# EAGLE design vfdhack32db (EAGLE 9.6.2)
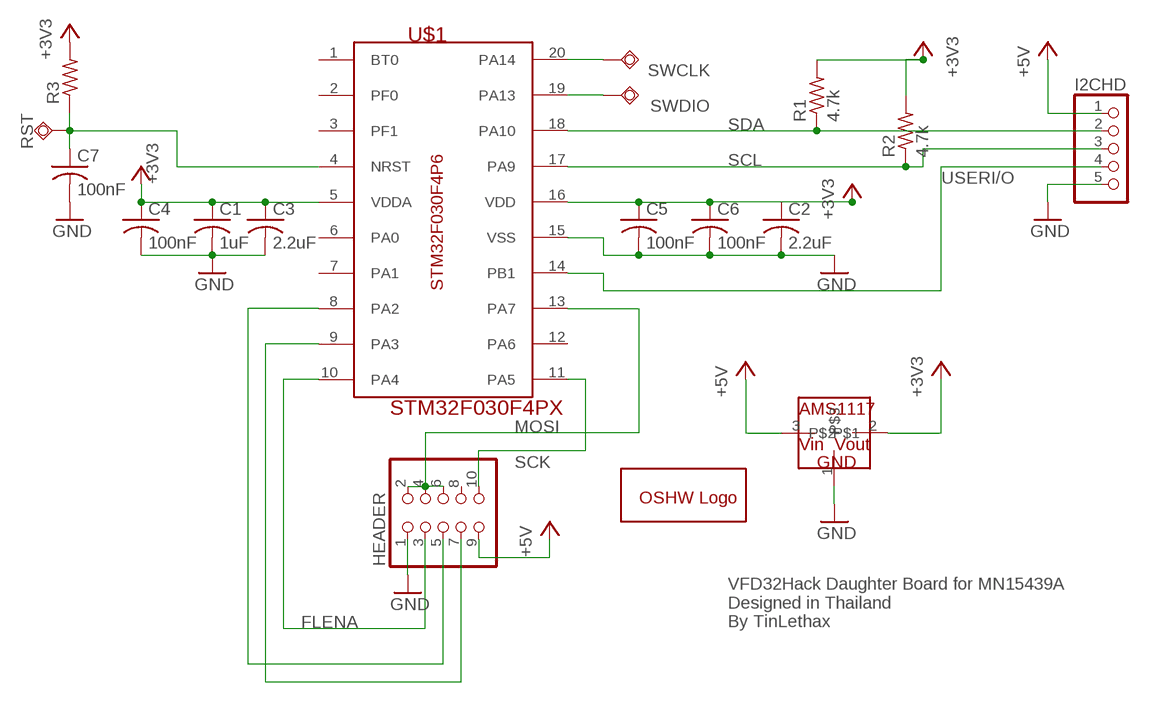
[diagram p0: schematic, sheet 1]

## Parts
C1  1uF  C-USC0603  [C0603]
C2  2.2uF  C-USC0603  [C0603]
C3  2.2uF  C-USC0603  [C0603]
C4  100nF  C-USC1206K  [C1206K]
C5  100nF  C-USC1206K  [C1206K]
C6  100nF  C-USC1206K  [C1206K]
C7  100nF  C-USC1206K  [C1206K]
GOLD_ORB_SM1  OSHWLOGOLOGO5MM  [OSHW_5MM]
HEADER  PINHD-2X5  [2X05]
I2CHD  PINHD-1X5  [1X05]
R1  4.7k  R-US_R0603  [R0603]
R2  4.7k  R-US_R0603  [R0603]
R3  R-US_R0603  [R0603]
RST  TPSQTP10SQ  [TP10SQ]
SWCLK  TPSQTP10SQ  [TP10SQ]
SWDIO  TPSQTP10SQ  [TP10SQ]
U$1  STM32F030F4PX  [SOP65P640X120-20N]
U$2  AMS1117  [SOT223]

## Nets
+3V3: C1.1 C2.1 C3.1 C4.1 C5.1 C6.1 R1.2 R2.2 R3.2 U$1.5(VDDA) U$1.16(VDD) U$2.2
+5V: HEADER.9 I2CHD.1 U$2.3
FLENA: HEADER.3 U$1.10(PA4)
GND: C1.2 C2.2 C3.2 C4.2 C5.2 C6.2 C7.2 HEADER.1 I2CHD.5 U$1.15(VSS) U$2.1
MOSI: HEADER.2 HEADER.4 HEADER.6 U$1.13(PA7)
N$2: C7.1 R3.1 RST.TP U$1.4(NRST)
N$3: SWCLK.TP U$1.20(PA14)
N$4: SWDIO.TP U$1.19(PA13)
N$5: HEADER.5 U$1.8(PA2)
N$6: HEADER.7 U$1.9(PA3)
SCK: HEADER.10 U$1.11(PA5)
SCL: I2CHD.3 R2.1 U$1.17(PA9)
SDA: I2CHD.2 R1.1 U$1.18(PA10)
USERI/O: I2CHD.4 U$1.14(PB1)
Unconnected: HEADER.8 U$1.1(BT0) U$1.2(PF0) U$1.3(PF1) U$1.6(PA0) U$1.7(PA1) U$1.12(PA6)

## Notes on the sheet
- VFD32Hack Daughter Board for MN15439A
  Designed in Thailand
  By TinLethax

## Library data of the parts
C1-C7 = adafruit:C-US: CAPACITOR, American symbol
GOLD_ORB_SM1 = oshw:OSHWLOGO: The OSHW logo for PCB layout
HEADER = pinhead:PINHD-2X5: PIN HEADER
I2CHD = pinhead:PINHD-1X5: PIN HEADER
R1-R3 = adafruit:R-US_: RESISTOR, American symbol
RST SWCLK SWDIO = testpad:TPSQ: Test pad
U$1 = stm32f030f4px:STM32F030F4PX: The STM32F030x4/x6/x8/xC microcontrollers incorporate the high-performance Arm® Cortex®-M0 32-bit RISC core operating at a 48 MHz frequency, high-speed embedded memories (up to 256 Kbytes of Flash memory and up to 32 Kbytes of SRAM), and an extensive range of enhanced peripherals and I/Os. All devices offer standard communication interfaces (up to two I2Cs, up to two SPIs and up to six USARTs), one 12-bit ADC, seven general-purpose 16-bit timers and an advanced-control PWM timer. The STM32F030x4/x6/x8/xC microcontrollers operate in the -40 to +85 °C temperature range from a 2.4 to 3.6V power supply. A comprehensive set of power-saving modes allows the design of low-power applications. The STM32F030x4/x6/x8/xC microcontrollers include devices in four different packages ranging from 20 pins to 64 pins. Depending on the device chosen, different sets of peripherals are included. The description below provides an overview of the complete range of STM32F030x4/x6/x8/xC peripherals proposed. These features make the STM32F030x4/x6/x8/xC microcontrollers suitable for a wide range of applications such as application control and user interfaces, handheld equipment, A/V receivers and digital TV, PC peripherals, gaming and GPS platforms, industrial applications, PLCs, inverters, printers, scanners, alarm systems, video intercoms, and HVACs.
U$2 = AMS1117:AMS1117: The The AMS1117 series of adjustable and fixed voltage regulators are designed to provide up to1A output current and to operate down to 1V input-to-output differential. The dropout voltage of the device is guaranteed maximum 1.3V, decreasing at lower load currents.; PARTNO: AMS1117

## Board
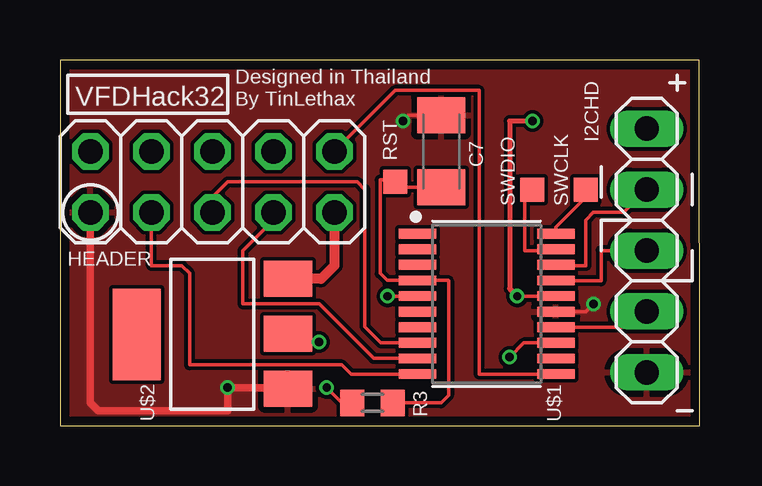
[diagram p1: board, top side]
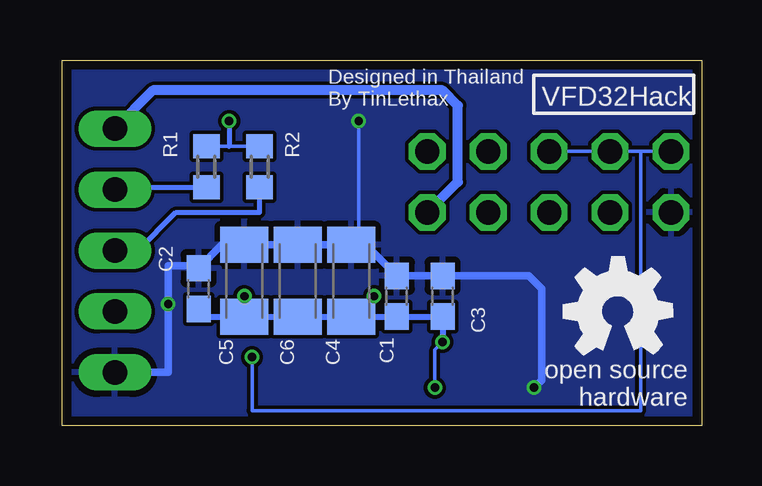
[diagram p2: board, bottom side, seen from below]

Size 26.65 x 15.24 mm. Coordinates in mm from the lower left corner, seen from the top.
Outline: 0,0 26.65,0 26.64,15.24 0,15.24 0,0
Copper layers (1*16): Top 0.035559375mm / dielectric 1.6mm / Bottom 0.035559375mm
Design rules "oshpark-2layer": minimum track width 6mil, minimum drill 10mil, track to track 6mil, track to pad 6mil, pad to pad 6mil, via to via 6mil, smd to smd 6mil, copper to edge 15mil, drill to drill 6mil, minimum pad ring 5mil, minimum via ring 5mil, stop-mask expansion 2.5mil, vias tented up to drill 0mil, thermal gap 10mil

### Footprints (pad centres in the part's own frame; a part is rotated, then mirrored left to right if it is on the bottom)
C0603 = smd 1.1 x 1: 1 -0.85,0; 2 0.85,0
C1206K = smd 1.5 x 2: 1 -1.5,0; 2 1.5,0
2X05 = drill 1.016 octagon: 1 -5.08,-1.27; 2 -5.08,1.27; 3 -2.54,-1.27; 4 -2.54,1.27; 5 0,-1.27; 6 0,1.27; 7 2.54,-1.27; 8 2.54,1.27; 9 5.08,-1.27; 10 5.08,1.27
1X05 = drill 1.016 long: 1 -5.08,0; 2 -2.54,0; 3 0,0; 4 2.54,0; 5 5.08,0
R0603 = smd 1 x 1.1: 1 -0.85,0; 2 0.85,0
TP10SQ = smd 1 x 1: TP 0,0
SOP65P640X120-20N = smd 1.559 x 0.407: 1 -2.878,2.925; 2 -2.878,2.275; 3 -2.878,1.625; 4 -2.878,0.975; 5 -2.878,0.325; 6 -2.878,-0.325; 7 -2.878,-0.975; 8 -2.878,-1.625; 9 -2.878,-2.275; 10 -2.878,-2.925; 11 2.878,-2.925; 12 2.878,-2.275; 13 2.878,-1.625; 14 2.878,-0.975; 15 2.878,-0.325; 16 2.878,0.325; 17 2.878,0.975; 18 2.878,1.625; 19 2.878,2.275; 20 2.878,2.925
SOT223 = smd 1.499 x 2.007: 1 -2.261,-3.15; 2 0.025,-3.15; 3 2.311,-3.15 | smd 3.81 x 2.007: 4 0,3.15

### Placement (x,y rotation side)
C1  12.7,5.4 90 bottom
C2  20.95,5.71 90 bottom
C3  10.79,5.4 90 bottom
C4  14.61,6.03 90 bottom
C5  19.05,6.03 90 bottom
C6  16.83,6.03 90 bottom
C7  15.88,11.43 90 top
GOLD_ORB_SM1  3.49,4.76 0 bottom
HEADER  6.35,10.16 0 top
I2CHD  24.45,7.3 270 top
R1  20.64,10.79 90 bottom
R2  18.41,10.79 90 bottom
R3  13.02,0.95 180 top
RST  13.97,10.16 0 top
SWCLK  21.91,9.84 0 top
SWDIO  19.68,9.84 0 top
U$1  17.78,5.08 0 top
U$2  6.35,3.81 90 top

### Tracks (layer width: path | path; a pad name or v marks a point on that pad's centre or on a via)
+3V3  (via drill 0.35)
  Top 0.152: v13.65,5.4 v13.66,5.41 U$1.5 | v19.05,5.4 v19.06,5.41 U$1.16 | R3.2 11.75,0.95 v11.11,1.59
  Top 0.203: v19.05,5.4 18.73,5.71 18.73,12.7 v19.68,12.7
  Top 0.254: v10.79,3.49 9.84,3.49 U$2.2
  Bottom 0.152: C4.1 13.74,5.4 v13.65,5.4 | C5.1 v19.05,5.4 | R1.2 19.68,11.64 R2.2 | v11.11,1.59 11.11,3.17 v10.79,3.49
  Bottom 0.203: v19.68,12.7 19.68,11.64
  Bottom 0.254: C2.1 20.62,4.53 C5.1 C6.1 C4.1 12.71,4.53 C1.1 C3.1 v10.79,3.49
+5V
  Top 0.406: HEADER.9 11.43,6.67 10.88,6.12 U$2.3
  Bottom 0.406: HEADER.9 10.16,10.16 10.16,13.34 10.79,13.97 22.86,13.97 I2CHD.1
FLENA
  Top 0.152: U$1.10 12.13,2.15 11.75,2.54 5.4,2.54 5.4,6.35 5.08,6.67 3.81,6.67 HEADER.3
GND  (via drill 0.35)
  Top 0.152: U$1.15 21.9,4.75 v22.23,5.08 | C7.2 14.52,12.93 v14.29,12.7
  Top 0.305: U$2.1 9.46,1.59 v6.99,1.59 6.99,0.64 1.59,0.64 1.27,0.95 HEADER.1
  Bottom 0.152: v14.29,12.7 14.29,7.85 C4.2
  Bottom 0.254: 19.99,7.53 C5.2 C6.2 15.33,7.53 15.24,7.62 14.69,7.62 C4.2
  Bottom 0.305: I2CHD.5 22.23,2.22 v22.23,5.08 22.23,6.67 21.06,6.67 C2.2 19.99,7.53 C4.2 13.98,7.53 C1.2 C3.2 7.2,6.25 6.67,5.71 6.67,1.91 v6.99,1.59
  pour Top: 0,15.24 26.67,15.24 26.67,0.32 26.67,0 0,0
  pour Bottom: 0,15.24 26.67,15.24 26.67,0 0,0
MOSI  (via drill 0.35)
  Top 0.152: U$1.13 19.33,3.46 v18.73,2.86
  Bottom 0.152: v18.73,2.86 18.73,0.64 2.54,0.64 2.54,11.43 | HEADER.2 2.54,11.43 | 2.54,11.43 HEADER.4 HEADER.6
N$2
  Top 0.152: C7.1 13.97,9.93 RST.TP 13.97,10.25 13.34,10.25 13.34,6.35 13.63,6.05 U$1.4 16.17,6.05 16.19,6.03 16.19,1.27 15.88,0.95 R3.1
N$3
  Top 0.152: SWCLK.TP 21.91,9.53 20.66,8.28 U$1.20
N$4
  Top 0.152: U$1.19 20.61,7.3 19.37,7.3 19.37,9.53 SWDIO.TP
N$5
  Top 0.152: HEADER.5 6.35,9.53 6.99,10.16 12.38,10.16 12.7,9.84 12.7,4.13 13.37,3.46 U$1.8
N$6
  Top 0.152: HEADER.7 8.89,8.57 7.62,7.3 7.62,5.08 10.79,5.08 13.07,2.81 U$1.9
SCK
  Top 0.152: U$1.11 17.46,2.15 17.46,13.97 13.97,13.97 HEADER.10
SCL
  Top 0.152: I2CHD.3 22.54,7.3 22.54,6.03 20.68,6.03 U$1.17
  Bottom 0.203: I2CHD.3 23.5,7.3 21.91,8.89 18.41,8.89 R2.1
SDA
  Top 0.152: I2CHD.2 23.5,8.89 22.23,8.89 21.91,8.57 21.91,6.67 20.7,6.67 U$1.18
  Bottom 0.203: I2CHD.2 24.34,9.95 R1.1
USERI/O
  Top 0.152: I2CHD.4 23.79,4.11 U$1.14

### Text on the board
tNames: VFDHack32 | Designed in Thailand / By TinLethax
bNames: VFD32Hack | Designed in Thailand / By TinLethax